# Altium schematic sheet 02-Mezzanine.SchDoc: ECE453 Power
size A; Date: 4/25/2017; ApprovedBy: JSK; CheckedBy: JSK; Author: JSK; CompanyName: University of Wisconsin; DrawnBy: JSK; Engineer: JSK; Organization: ECE 315; Address1: College of Engineering; Address2: 1415 Engineering Drive; Address3: Madison, WI 53706; Address4: ECE 453 Fall 2022; Revision: A; SheetNumber: 2; SheetTotal: 2; AssemblyNumber: ECE453-F22-01
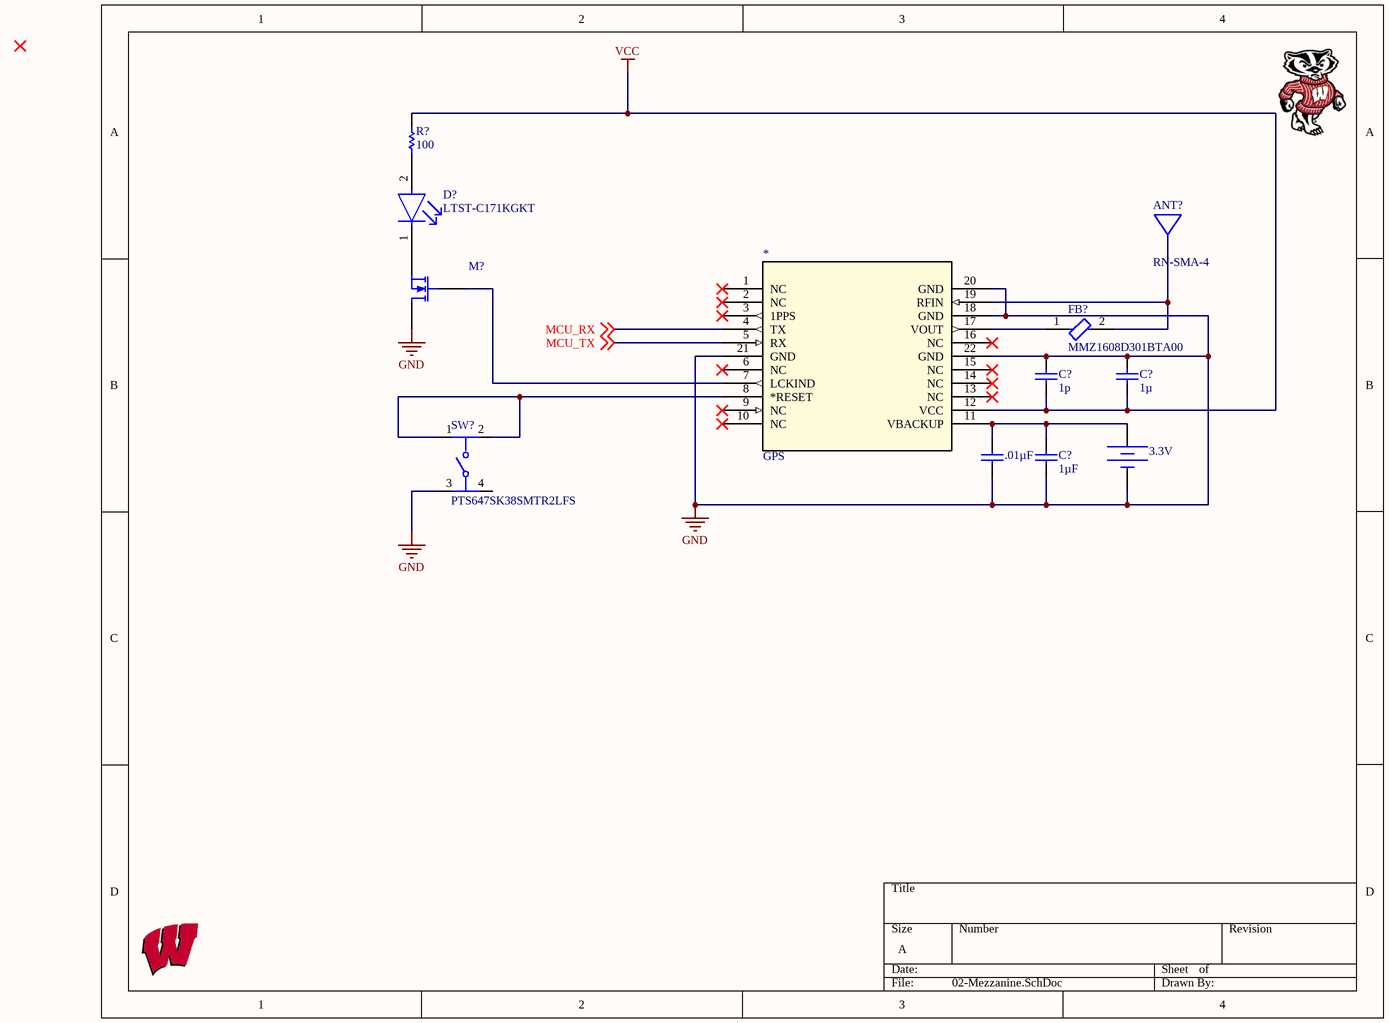
[diagram p0: 02-Mezzanine.SchDoc]

## Parts
(Parts that share a designator on the sheet are numbered #1, #2 ... from top to bottom, then left to right.)
3.3V  Constant Voltage Source  (value not drawn)
*  GPS
.01µF  Capacitor  (value not drawn)
ANT?  RN-SMA-4  [FP-RN-SMA-4-MFG]
C?#1  value 1p  (hidden comment: Capacitor)
C?#2  value 1µ  (hidden comment: Capacitor)
C?#3  value 1µF  (hidden comment: Capacitor)
D?  LTST-C171KGKT  [FP-LTST-C171KGKT-MFG]
FB?  MMZ1608D301BTA00  [FP-MMZ1608-0_8-MFG]
M?  N-chanel Power MOSFET VDMOS Model  (value not drawn)
R?  value 100  (hidden comment: Resistor)
SW?  PTS647SK38SMTR2LFS  [FP-PTS647SK38SMTR2LFS-MFG]

## Nets
GND: 3.3V.2 *.18(GND) *.20(GND) *.21(GND) *.22(GND) .01µF.1 C?#1.2 C?#2.2 C?#3.1 M?.1(D) SW?.3
VCC: *.12(VCC) C?#1.1 C?#2.1 R?.2
MCU_RX: *.4(TX) ; off-sheet MCU_RX
MCU_TX: *.5(RX) ; off-sheet MCU_TX
Net3.3V_1: 3.3V.1 *.11(VBACKUP) .01µF.2 C?#3.2
Net*_7: *.7(LCKIND) M?.2(G)
Net*_8: *.8(*RESET) SW?.1 SW?.2
Net*_17: *.17(VOUT) FB?.1
Net*_19: *.19(RFIN) FB?.2
NetD?_1: D?.1(C) M?.3(S)
NetD?_2: D?.2(A) R?.1

Not connected (* = marked no-connect by the designer): * 1(NC)* 2(NC)* 3(1PPS)* 6(NC)* 9(NC)* 10(NC)* 13(NC)* 14(NC)* 15(NC)* 16(NC)*; SW? 4

## Library data of the parts
3.3V = Battery: SimulationGenericComponent: True; DC Magnitude: 5
.01µF C?#1-C?#3 = Capacitor: SimulationGenericComponent: True
ANT? = CMP-06329-000002-1: RF ANT 2.4GHZ WHIP SMA MALE 4"; Number of Bands: 1; Input Impedance: 50R; VSWR: 1.9; Bandwidth: 120MHz; Frequency: 2.45GHz; REACH SVHC: No SVHC; Height: 4.449inch; Packaging: Bulk; Case/Package: SMA; Package Quantity: 1; Lead Free: Lead Free; Series: -; Termination: SMA; Connector Type: SMA; Radiation Hardening: No; Impedance: 50R; Mount: Connector
D? = CMP-22017-000037-1: LED GREEN CLEAR SMD; Number of LEDs: 1; Viewing Angle: 130°; Lens Style: Rectangular; Dominant Wavelength: 571nm; Test Current: 20mA; Luminous Intensity: 35mcd; Power Rating: 75mW; Forward Voltage: 2.4V; Forward Current: 30mA; Reverse Voltage: 5V; Lens Color: Colorless; Wavelength: 574nm; Height: 0.8mm; Illumination Color: Green; Length: 2mm; Case/Package: 0805; Number of Pins: 2; Number of Elements: 1; Package Quantity: 1; Depth: 1.25mm; Lens Transparency: Clear; Width: 1.25mm; Color: Green; Radiation Hardening: No; Mount: Surface Mount; Packaging: Tape and Reel; Case Code (Metric): 2012; Lead Free: Lead Free; Max Operating Temperature: 85°C; Min Operating Temperature: -55°C; Case Code (Imperial): 0805; Power Dissipation: 75mW
FB? = CMP-08257-000452-1: Signal Line Ferrite Bead 300Ω  @ 100MHz 300mA DCR 700mΩ SMD 0603; DC Resistance (DCR): 700mR; Impedance: 300R; Case/Package: 0603; Max DC Current: 300mA; REACH SVHC: No SVHC; Case Code (Imperial): 0603; Case Code (Metric): 1608; Length: 0.063inch; Mount: Surface Mount; RoHS Compliant: Yes; Current Rating: 300mA; Packaging: Cut Tape; Width: 0.031inch; Height: 0.037inch; Package Quantity: 4000; Series: MMZ
M? = MOSFET P-ch VDMOS: XTI: 0; A: 1; BV: 1e30; EG: 1.11; FC: 0.5; IBV: 1e-10; IS: 1e-14; PHI: 0.6; TNOM: 27; VJ: 0.8; SimulationGenericComponent: True; CGDMAX: 0; CGDMIN: 0; CGS: 0; CJO: 0; KP: 1; KSUBTHRES: 0; LAMBDA: 0; M: 0.5; MTRIODE: 1; N: 1; NBV: 1; NCHAN: 1; PCHAN: 1; RB: 0; RD: 0; RDS: 1e30; RG: 0; RQ: 0; RS: 0; SUBSHIFT: 0; SUBSLOPE: 0; THETA: 0; TT: 0; VQ: 0; VTO: 0
R? = Resistor: TC1: 0; SimulationGenericComponent: True; TC2: 0
SW? = CMP-10040-000033-1: TACT 4.5 X 4.5, 3.8 MM H, 2.5N,; Switch Function: Off-Mom; Switch Travel: 0.25mm; Actuator Type: Standard; Illumination Type: Non-Illuminated; Mechanical Life: 100000Cycles; Ratings: IP40; Operating Force: 250gf; Throw Configuration: SPST; Max Operating Temperature: 70°C; Min Operating Temperature: -20°C; Termination: Gull Wing; Mount: Surface Mount; Packaging: Tape and Reel